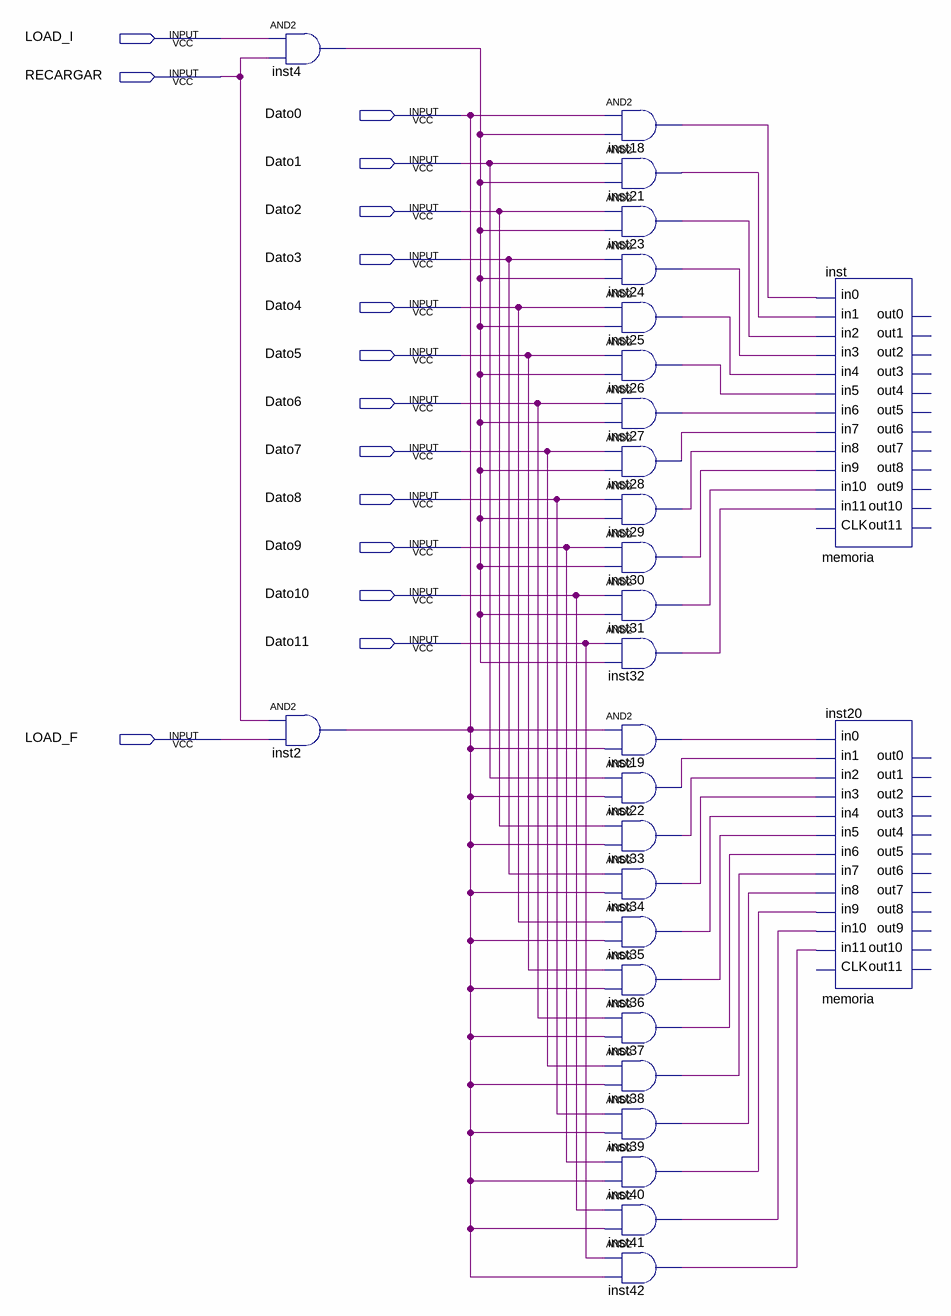
[diagram p0: schematic sheet]
// Quartus schematic main2.bdf as structural Verilog: 28 symbols, 15 pins
module main2 (
  input  LOAD_I,
  input  RECARGAR,
  input  Dato0,
  input  Dato1,
  input  Dato2,
  input  Dato3,
  input  Dato4,
  input  Dato5,
  input  Dato6,
  input  Dato7,
  input  Dato8,
  input  Dato9,
  input  Dato10,
  input  Dato11,
  input  LOAD_F
);

  wire inst4_out, inst18_out, inst19_out, inst21_out, inst22_out, inst23_out, inst24_out, inst25_out,
       inst26_out, inst27_out, inst28_out, inst29_out, inst30_out, inst31_out, inst32_out, inst33_out,
       inst34_out, inst35_out, inst36_out, inst37_out, inst38_out, inst39_out, inst40_out, inst41_out,
       inst42_out;

  and inst4 (inst4_out, LOAD_I, RECARGAR);
  and inst2 (Dato0, RECARGAR, LOAD_F);
  and inst18 (inst18_out, Dato0, inst4_out);
  and inst21 (inst21_out, Dato1, inst4_out);
  and inst23 (inst23_out, Dato2, inst4_out);
  and inst24 (inst24_out, Dato3, inst4_out);
  and inst25 (inst25_out, Dato4, inst4_out);
  and inst26 (inst26_out, Dato5, inst4_out);
  and inst27 (inst27_out, Dato6, inst4_out);
  and inst28 (inst28_out, Dato7, inst4_out);
  and inst29 (inst29_out, Dato8, inst4_out);
  and inst30 (inst30_out, Dato9, inst4_out);
  and inst31 (inst31_out, Dato10, inst4_out);
  and inst32 (inst32_out, Dato11, inst4_out);
  and inst19 (inst19_out, Dato0, Dato0);
  and inst22 (inst22_out, Dato1, Dato0);
  and inst33 (inst33_out, Dato2, Dato0);
  and inst34 (inst34_out, Dato3, Dato0);
  and inst35 (inst35_out, Dato4, Dato0);
  and inst36 (inst36_out, Dato5, Dato0);
  and inst37 (inst37_out, Dato6, Dato0);
  and inst38 (inst38_out, Dato7, Dato0);
  and inst39 (inst39_out, Dato8, Dato0);
  and inst40 (inst40_out, Dato9, Dato0);
  and inst41 (inst41_out, Dato10, Dato0);
  and inst42 (inst42_out, Dato11, Dato0);
  memoria inst (
    .in11(inst32_out), .in10(inst31_out), .in9(inst30_out), .in8(inst29_out), .in7(inst28_out),
    .in6(inst27_out), .in5(inst26_out), .in4(inst25_out), .in3(inst24_out), .in2(inst23_out),
    .in1(inst21_out), .in0(inst18_out));  // open: CLK, out11, out10, out9, out8, out7, out6, out5, out4, out3, out2, out1, out0
  memoria inst20 (
    .in11(inst42_out), .in10(inst41_out), .in9(inst40_out), .in8(inst39_out), .in7(inst38_out),
    .in6(inst37_out), .in5(inst36_out), .in4(inst35_out), .in3(inst34_out), .in2(inst33_out),
    .in1(inst22_out), .in0(inst19_out));  // open: CLK, out11, out10, out9, out8, out7, out6, out5, out4, out3, out2, out1, out0
endmodule
